# Altium schematic sheet STM32F103最小系统板.SchDoc
size A3
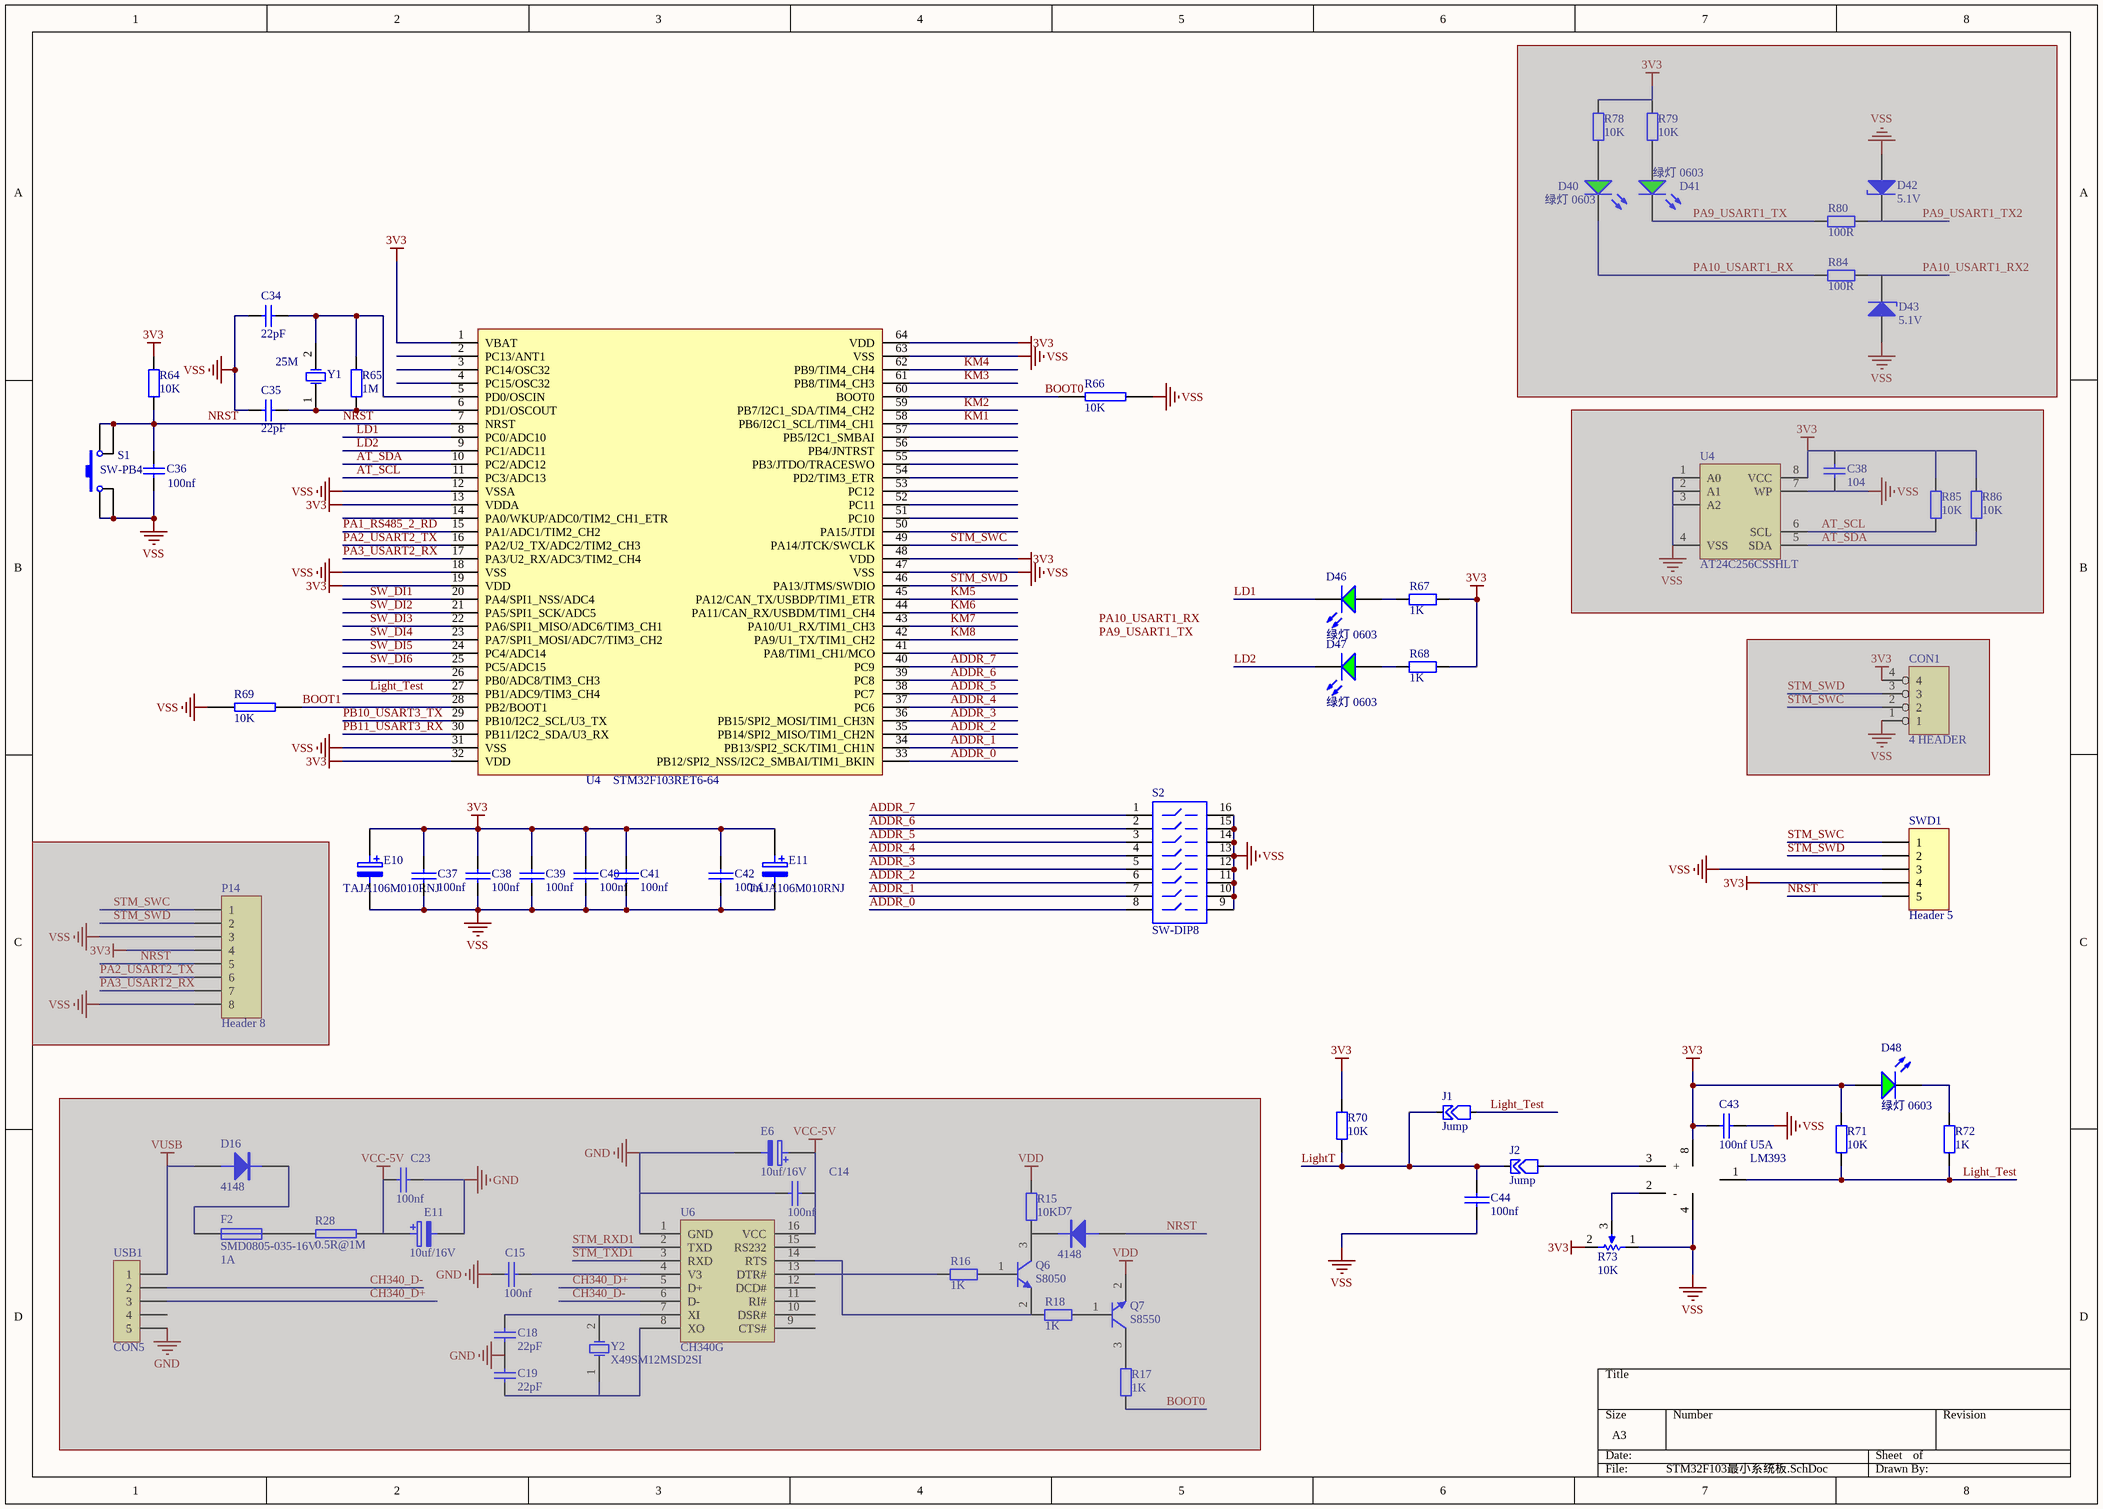
[diagram p0: STM32F103最小系统板.SchDoc]

## Parts
(Parts that share a designator on the sheet are numbered #1, #2 ... from top to bottom, then left to right.)
C14  100nf  [LC-0603_C]  (masked out: inside a compile mask, not in the netlist)
C15  100nf  [LC-0603_C]  (masked out: inside a compile mask, not in the netlist)
C18  22pF  [LC-0603_C]  (masked out: inside a compile mask, not in the netlist)
C19  22pF  [LC-0603_C]  (masked out: inside a compile mask, not in the netlist)
C23  100nf  [LC-0603_C]  (masked out: inside a compile mask, not in the netlist)
C34  22pF  [LC-0603_C]
C35  22pF  [LC-0603_C]
C36  100nf  [LC-0603_C]
C37  100nf  [LC-0603_C]
C38#1  104  [LC-0603_C]  (masked out: inside a compile mask, not in the netlist)
C38#2  100nf  [LC-0603_C]
C39  100nf  [LC-0603_C]
C40  100nf  [LC-0603_C]
C41  100nf  [LC-0603_C]
C42  100nf  [LC-0603_C]
C43  100nf  [LC-0603_C]
C44  100nf  [LC-0603_C]
CON1  4 HEADER  [sip4]  (masked out: inside a compile mask, not in the netlist)
D7  4148  [LC-LL-34]  (masked out: inside a compile mask, not in the netlist)
D16  4148  [LC-LL-34]  (masked out: inside a compile mask, not in the netlist)
D40  绿灯 0603  [0603_LED_G]  (masked out: inside a compile mask, not in the netlist)
D41  绿灯 0603  [0603_LED_G]  (masked out: inside a compile mask, not in the netlist)
D42  value 5.1V  [D-1206]  (hidden comment: Diode-Z)  (masked out: inside a compile mask, not in the netlist)
D43  value 5.1V  [D-1206]  (hidden comment: Diode-Z)  (masked out: inside a compile mask, not in the netlist)
D46  绿灯 0603  [LC-0603_LED_S1]
D47  绿灯 0603  [LC-0603_LED_S1]
D48  绿灯 0603  [0603_LED_G]
E6  10uf/16V  [LC-CASE-A_3216]  (masked out: inside a compile mask, not in the netlist)
E10  TAJA106M010RNJ  [LC-CASE-A_3216]
E11#1  TAJA106M010RNJ  [LC-CASE-A_3216]
E11#2  10uf/16V  [LC-CASE-A_3216]  (masked out: inside a compile mask, not in the netlist)
F2  SMD0805-035-16V  value 1A  [LC-0805_R]  (masked out: inside a compile mask, not in the netlist)
J1  Jump  [JT]
J2  Jump  [JT]
P14  Header 8  [HDR1X8]  (masked out: inside a compile mask, not in the netlist)
Q6  S8050  [LC-SOT-23(SOT-23-3)]  (masked out: inside a compile mask, not in the netlist)
Q7  S8550  [LC-SOT-23(SOT-23-3)]  (masked out: inside a compile mask, not in the netlist)
R15  10K  [LC-0603_R]  (masked out: inside a compile mask, not in the netlist)
R16  1K  [LC-0603_R]  (masked out: inside a compile mask, not in the netlist)
R17  1K  [LC-0603_R]  (masked out: inside a compile mask, not in the netlist)
R18  1K  [LC-0603_R]  (masked out: inside a compile mask, not in the netlist)
R28  0.5R@1M  [LC-0805_R]  (masked out: inside a compile mask, not in the netlist)
R64  10K  [LC-0603_R]
R65  1M  [LC-0603_R]
R66  10K  [LC-0603_R]
R67  1K  [LC-0603_R]
R68  1K  [LC-0603_R]
R69  10K  [LC-0603_R]
R70  value 10K  [LC-0603_R]  (hidden comment: 1K)
R71  value 10K  [LC-0603_R]  (hidden comment: 1K)
R72  1K  [LC-0603_R]
R73  10K  [3296W]
R78  10K  [LC-0603_R]  (masked out: inside a compile mask, not in the netlist)
R79  10K  [LC-0603_R]  (masked out: inside a compile mask, not in the netlist)
R80  value 100R  [LC-0603_R]  (hidden comment: 1K)  (masked out: inside a compile mask, not in the netlist)
R84  value 100R  [LC-0603_R]  (hidden comment: 1K)  (masked out: inside a compile mask, not in the netlist)
R85  10K  [LC-0603_R]  (masked out: inside a compile mask, not in the netlist)
R86  10K  [LC-0603_R]  (masked out: inside a compile mask, not in the netlist)
S1  SW-PB4  [sw-4]
S2  SW-DIP8  [SW-DIP8]
SWD1  Header 5  [SWD_5]
U4#1  STM32F103RET6-64  [LC-LQFP-64_10x10x05P]
U4#2  AT24C256CSSHLT  [SOIC-8]  (masked out: inside a compile mask, not in the netlist)
U5  LM393  [sop-8]  (part A of 2)
U6  CH340G  [LC-SOIC-16_150mil]
USB1  CON5  [USB_MICRO]  (masked out: inside a compile mask, not in the netlist)
Y1  25M  [LC-SMD-5032_2P]
Y2  X49SM12MSD2SI  [LC-HC-49SMD]  (masked out: inside a compile mask, not in the netlist)

## Nets
3V3: C37.2 C38#2.2 C39.2 C40.2 C41.2 C42.2 C43.2 D48.A E10.1 E11#1.1 R64.2 R67.1 R68.1 R70.1 R71.1 R73.2(BOT) SWD1.4 U4#1.1(VBAT) U4#1.13(VDDA) U4#1.19(VDD) U4#1.32(VDD) U4#1.48(VDD) U4#1.64(VDD) U5.8(VCC)
VSS: C34.1 C35.1 C36.1 C37.1 C38#2.1 C39.1 C40.1 C41.1 C42.1 C43.1 C44.1 E10.2 E11#1.2 R66.1 R69.1 R73.1(TOP) S1.1 S1.4 S2.9 S2.10 S2.11 S2.12 S2.13 S2.14 S2.15 S2.16 SWD1.3 U4#1.12(VSSA) U4#1.18(VSS) U4#1.31(VSS) U4#1.47(VSS) U4#1.63(VSS) U5.4(GND)
ADDR_0: S2.8 U4#1.33(PB12/SPI2_NSS/I2C2_SMBAI/TIM1_BKIN)
ADDR_1: S2.7 U4#1.34(PB13/SPI2_SCK/TIM1_CH1N)
ADDR_2: S2.6 U4#1.35(PB14/SPI2_MISO/TIM1_CH2N)
ADDR_3: S2.5 U4#1.36(PB15/SPI2_MOSI/TIM1_CH3N)
ADDR_4: S2.4 U4#1.37(PC6)
ADDR_5: S2.3 U4#1.38(PC7)
ADDR_6: S2.2 U4#1.39(PC8)
ADDR_7: S2.1 U4#1.40(PC9)
AT_SCL: U4#1.11(PC3/ADC13)
AT_SDA: U4#1.10(PC2/ADC12)
BOOT0: R66.2 U4#1.60(BOOT0)
BOOT1: R69.2 U4#1.28(PB2/BOOT1)
KM1: U4#1.58(PB6/I2C1_SCL/TIM4_CH1)
KM2: U4#1.59(PB7/I2C1_SDA/TIM4_CH2)
KM3: U4#1.61(PB8/TIM4_CH3)
KM4: U4#1.62(PB9/TIM4_CH4)
KM5: U4#1.45(PA12/CAN_TX/USBDP/TIM1_ETR)
KM6: U4#1.44(PA11/CAN_RX/USBDM/TIM1_CH4)
KM7: U4#1.43(PA10/U1_RX/TIM1_CH3)
KM8: U4#1.42(PA9/U1_TX/TIM1_CH2)
LD1: D46.K U4#1.8(PC0/ADC10)
LD2: D47.K U4#1.9(PC1/ADC11)
Light_Test: J1.2(GND) R71.2 R72.2 U4#1.27(PB1/ADC9/TIM3_CH4) U5.1(out)
LightT: C44.2 J1.1(GND) J2.1(GND) R70.2
NRST: C36.2 R64.1 S1.2 S1.3 SWD1.5 U4#1.7(NRST)
PA1_RS485_2_RD: U4#1.15(PA1/ADC1/TIM2_CH2)
PA2_USART2_TX: U4#1.16(PA2/U2_TX/ADC2/TIM2_CH3)
PA3_USART2_RX: U4#1.17(PA3/U2_RX/ADC3/TIM2_CH4)
PB10_USART3_TX: U4#1.29(PB10/I2C2_SCL/U3_TX)
PB11_USART3_RX: U4#1.30(PB11/I2C2_SDA/U3_RX)
STM_SWC: SWD1.1 U4#1.49(PA14/JTCK/SWCLK)
STM_SWD: SWD1.2 U4#1.46(PA13/JTMS/SWDIO)
SW_DI1: U4#1.20(PA4/SPI1_NSS/ADC4)
SW_DI2: U4#1.21(PA5/SPI1_SCK/ADC5)
SW_DI3: U4#1.22(PA6/SPI1_MISO/ADC6/TIM3_CH1)
SW_DI4: U4#1.23(PA7/SPI1_MOSI/ADC7/TIM3_CH2)
SW_DI5: U4#1.24(PC4/ADC14)
SW_DI6: U4#1.25(PC5/ADC15)
NetC34_2: C34.2 R65.2 U4#1.5(PD0/OSCIN) Y1.2(OSC2)
NetC35_2: C35.2 R65.1 U4#1.6(PD1/OSCOUT) Y1.1(OSC1)
NetD46_A: D46.A R67.2
NetD47_A: D47.A R68.2
NetD48_K: D48.K R72.1
NetJ2_2: J2.2(GND) U5.3(+)
NetR73_3: R73.3(TAP) U5.2(-)

Not connected (* = marked no-connect by the designer): U4#1 2(PC13/ANT1) 3(PC14/OSC32) 4(PC15/OSC32) 14(PA0/WKUP/ADC0/TIM2_CH1_ETR) 26(PB0/ADC8/TIM3_CH3) 41(PA8/TIM1_CH1/MCO) 50(PA15/JTDI) 51(PC10) 52(PC11) 53(PC12) 54(PD2/TIM3_ETR) 55(PB3/JTDO/TRACESWO) 56(PB4/JNTRST) 57(PB5/I2C1_SMBAI); U6 1(GND) 2(TXD) 3(RXD) 4(V3) 5(D+) 6(D-) 7(XI) 8(XO) 9(CTS#) 10(DSR#) 11(RI#) 12(DCD#) 13(DTR#) 14(RTS) 15(RS232) 16(VCC)

## Notes on the sheet
- Labels drawn without touching a wire or pin: PA9_USART1_TX, PA10_USART1_RX

## Library data of the parts
C14 C15 C23 C37 C38#2 C39-C44 = CAP: Capacitor
C18 C19 C34 C35 = Cap: Capacitor; Published: 8-Jun-2000; LatestRevisionDate: 17-Jul-2002; LatestRevisionNote: Re-released for DXP Platform.; PackageReference: RAD-0.3; Publisher: Altium Limited; Value: 22pF
C36 = Cap: Capacitor; Value: 0.1uF; Published: 8-Jun-2000; LatestRevisionDate: 17-Jul-2002; LatestRevisionNote: Re-released for DXP Platform.; PackageReference: RAD-0.3; Publisher: Altium Limited
C38#1 = CAP: Capacitor; Value: 100nF; Published: 8-Jun-2000; Revision: July-2002: Re-released for DXP Platform.; Publisher: Altium Limited
CON1 = 4 HEADER: 4 Pin Header
D7 D16 = DIODE
D40 D41 D46-D48 = 0: 发光二极管; ComponentLink1Description: 供应商链接; ComponentLink1URL: http://www.szlcsc.com/product/details_73152.html; Package: 0603; Supplier: LC; SuppliersPartNumber: C72043
D42 D43 = Diode-Z: 稳压二极管; Published: 8-Jun-2000; LatestRevisionDate: 17-Jul-2002; LatestRevisionNote: Re-released for DXP Platform.; PackageReference: SMB; Publisher: Altium Limited; Code_JEDEC: DO-214-AA
E6 E10 E11#1 E11#2 = ELECTRO2: Electrolytic Capacitor
F2 = F: 保险丝
P14 = Header 8: Header, 8-Pin; LatestRevisionDate: 17-Jul-2002; LatestRevisionNote: Re-released for DXP Platform.; Publisher: Altium Limited
Q7 = S8050
R15 R64 R78 R79 R85 R86 = Res2: Resistor; Published: 8-Jun-2000; LatestRevisionDate: 17-Jul-2002; LatestRevisionNote: Re-released for DXP Platform.; PackageReference: AXIAL-0.4; Publisher: Altium Limited; Value: 10K
R16-R18 R65 = Res2: Resistor; Value: 10K; Published: 8-Jun-2000; LatestRevisionDate: 17-Jul-2002; LatestRevisionNote: Re-released for DXP Platform.; PackageReference: AXIAL-0.4; Publisher: Altium Limited
R28 R66 R69 = RES2
R67 R68 R70-R72 R80 R84 = R: 贴片电阻; Published: 8-Jun-2000; LatestRevisionDate: 17-Jul-2002; LatestRevisionNote: Re-released for DXP Platform.; PackageReference: AXIAL-0.4; Publisher: Altium Limited
  R67 R68 R72: Value: 1K
R73 = RPot: Potentiometer; Sim Note: Enter the Resistance value and the set point into parameter fields.; Set Position: 0.5; Published: 8-Jun-2000; LatestRevisionDate: 17-Jul-2002; LatestRevisionNote: Re-released for DXP Platform.; PackageReference: VR5; Publisher: Altium Limited; PackageDescription: Variable Resistor, Thru-Hole; 3 Leads; Value: 10K
S1 = SW-: 微动开关; Published: 24-Mar-1999; LatestRevisionDate: 17-Jul-2002; LatestRevisionNote: Re-released for DXP Platform.; PackageReference: SPST-2; Publisher: Altium Limited
S2 = SW-DIP8: 4009 Series DIP Switch, Raised actuator; Published: 24-Mar-1999; LatestRevisionDate: 17-Dec-2003; LatestRevisionNote: PCB Footprint replaced.; PackageReference: DIP-16-KEY; Publisher: Altium Limited; PackageDescription: DIP; 16 Leads; Row Spacing 7.62 mm; Pitch 2.54 mm; ComponentLink1Description: Manufacturer Link; ComponentLink1URL: http://www.oupiin.com/prodindx.html#Headers
SWD1 = Header 5: Header, 5-Pin; LatestRevisionDate: 17-Jul-2002; LatestRevisionNote: Re-released for DXP Platform.; Publisher: Altium Limited
U4#1 = STM32F103RBT6
U4#2 = AT24C02: EEROM存储器
USB1 = CON5: Connector
Y1 Y2 = XTAL: Crystal Oscillator; Published: 8-Jun-2000; LatestRevisionDate: 17-Jul-2002; LatestRevisionNote: Re-released for DXP Platform.; PackageReference: R38; Publisher: Altium Limited